# EAGLE schematic Schema (EAGLE 9.7.0)
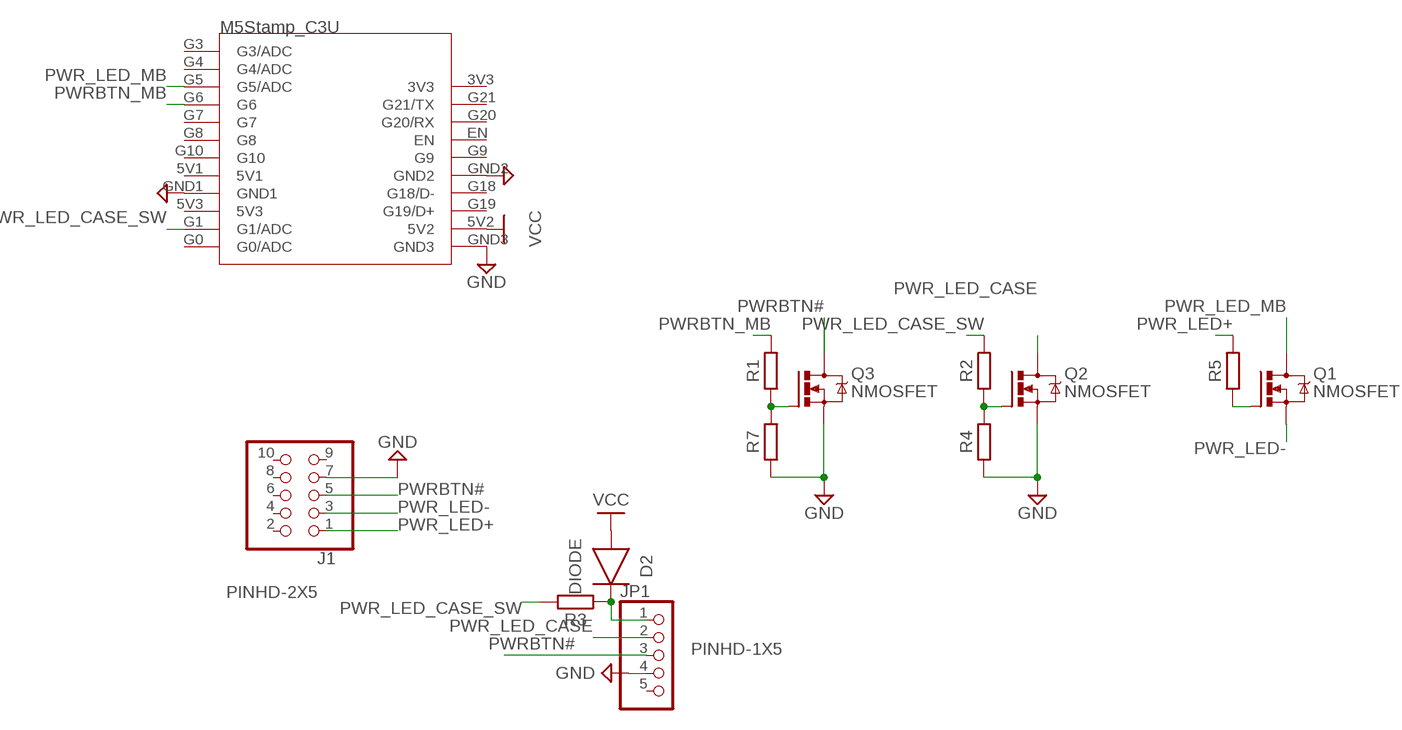
[diagram p0: schematic, sheet 1]

## Parts
D2  DIODE  DIODE_DO-219-AB(SOD123F)  [SODFL3718X115]
J1  PINHD-2X5  [2X05]
JP1  PINHD-1X5  [1X05]
Q1  NMOSFET  NMOSFET_SOT23-GSD  [SOT23]
Q2  NMOSFET  NMOSFET_SOT23-GSD  [SOT23]
Q3  NMOSFET  NMOSFET_SOT23-GSD  [SOT23]
R1  R_CHIP-0603(1608-METRIC)  [RESC1608X60]
R2  R_CHIP-0603(1608-METRIC)  [RESC1608X60]
R3  R_CHIP-0603(1608-METRIC)  [RESC1608X60]
R4  R_CHIP-0603(1608-METRIC)  [RESC1608X60]
R5  R_CHIP-0603(1608-METRIC)  [RESC1608X60]
R7  R_CHIP-0603(1608-METRIC)  [RESC1608X60]
U$1  M5STAMP_C3UHEADER  [M5STAMP_C3U_HEADER]

## Nets
GND: J1.7 JP1.4 Q2.2(S) Q3.2(S) R4.1 R7.1 U$1.GND1 U$1.GND2 U$1.GND3
N$1: Q3.1(G) R1.1 R7.2
N$2: Q2.1(G) R2.1 R4.2
N$4: D2.1(C) JP1.1 R3.1
N$5: Q1.1(G) R5.1
PWR_LED+: J1.1 R5.2
PWR_LED-: J1.3 Q1.2(S)
PWR_LED_CASE: JP1.2 Q2.3(D)
PWR_LED_CASE_SW: R2.2 R3.2 U$1.G1(G1/ADC)
PWR_LED_MB: Q1.3(D) U$1.G5(G5/ADC)
PWRBTN#: J1.5 JP1.3 Q3.3(D)
PWRBTN_MB: R1.2 U$1.G6
VCC: D2.2(A) U$1.5V2
Unconnected: J1.2 J1.4 J1.6 J1.8 J1.9 J1.10 JP1.5 U$1.3V3 U$1.5V1 U$1.5V3 U$1.EN U$1.G0(G0/ADC) U$1.G3(G3/ADC) U$1.G4(G4/ADC) U$1.G7 U$1.G8 U$1.G9 U$1.G10 U$1.G18(G18/D-) U$1.G19(G19/D+) U$1.G20(G20/RX) U$1.G21(G21/TX)

## Library data of the parts
D2 = Diode:DIODE: Diode Rectifier - Generic; CATEGORY: Diode; SUB-CATEGORY: Rectifier
J1 = Connector:PINHD-2X5: PIN HEADER; CATEGORY: CONNECTOR; SUB-CATEGORY: PIN-HEADER
JP1 = Connector:PINHD-1X5: PIN HEADER; CATEGORY: CONNECTOR; SUB-CATEGORY: PIN-HEADER
Q1-Q3 = Transistor:NMOSFET: N-Channel MOSFET - Generic; CATEGORY: Transistor; SUB-CATEGORY: MOSFET; TYPE: N-Channel
R1-R5 R7 = Resistor:R: Resistor Fixed - Generic; CATEGORY: Resistor; SUB-CATEGORY: Fixed
U$1 = M5Stamp:M5STAMP_C3U